# Altium schematic sheet SMPS_Template.SchDoc
size A3 portrait; SheetNumber: 1; SheetTotal: 1
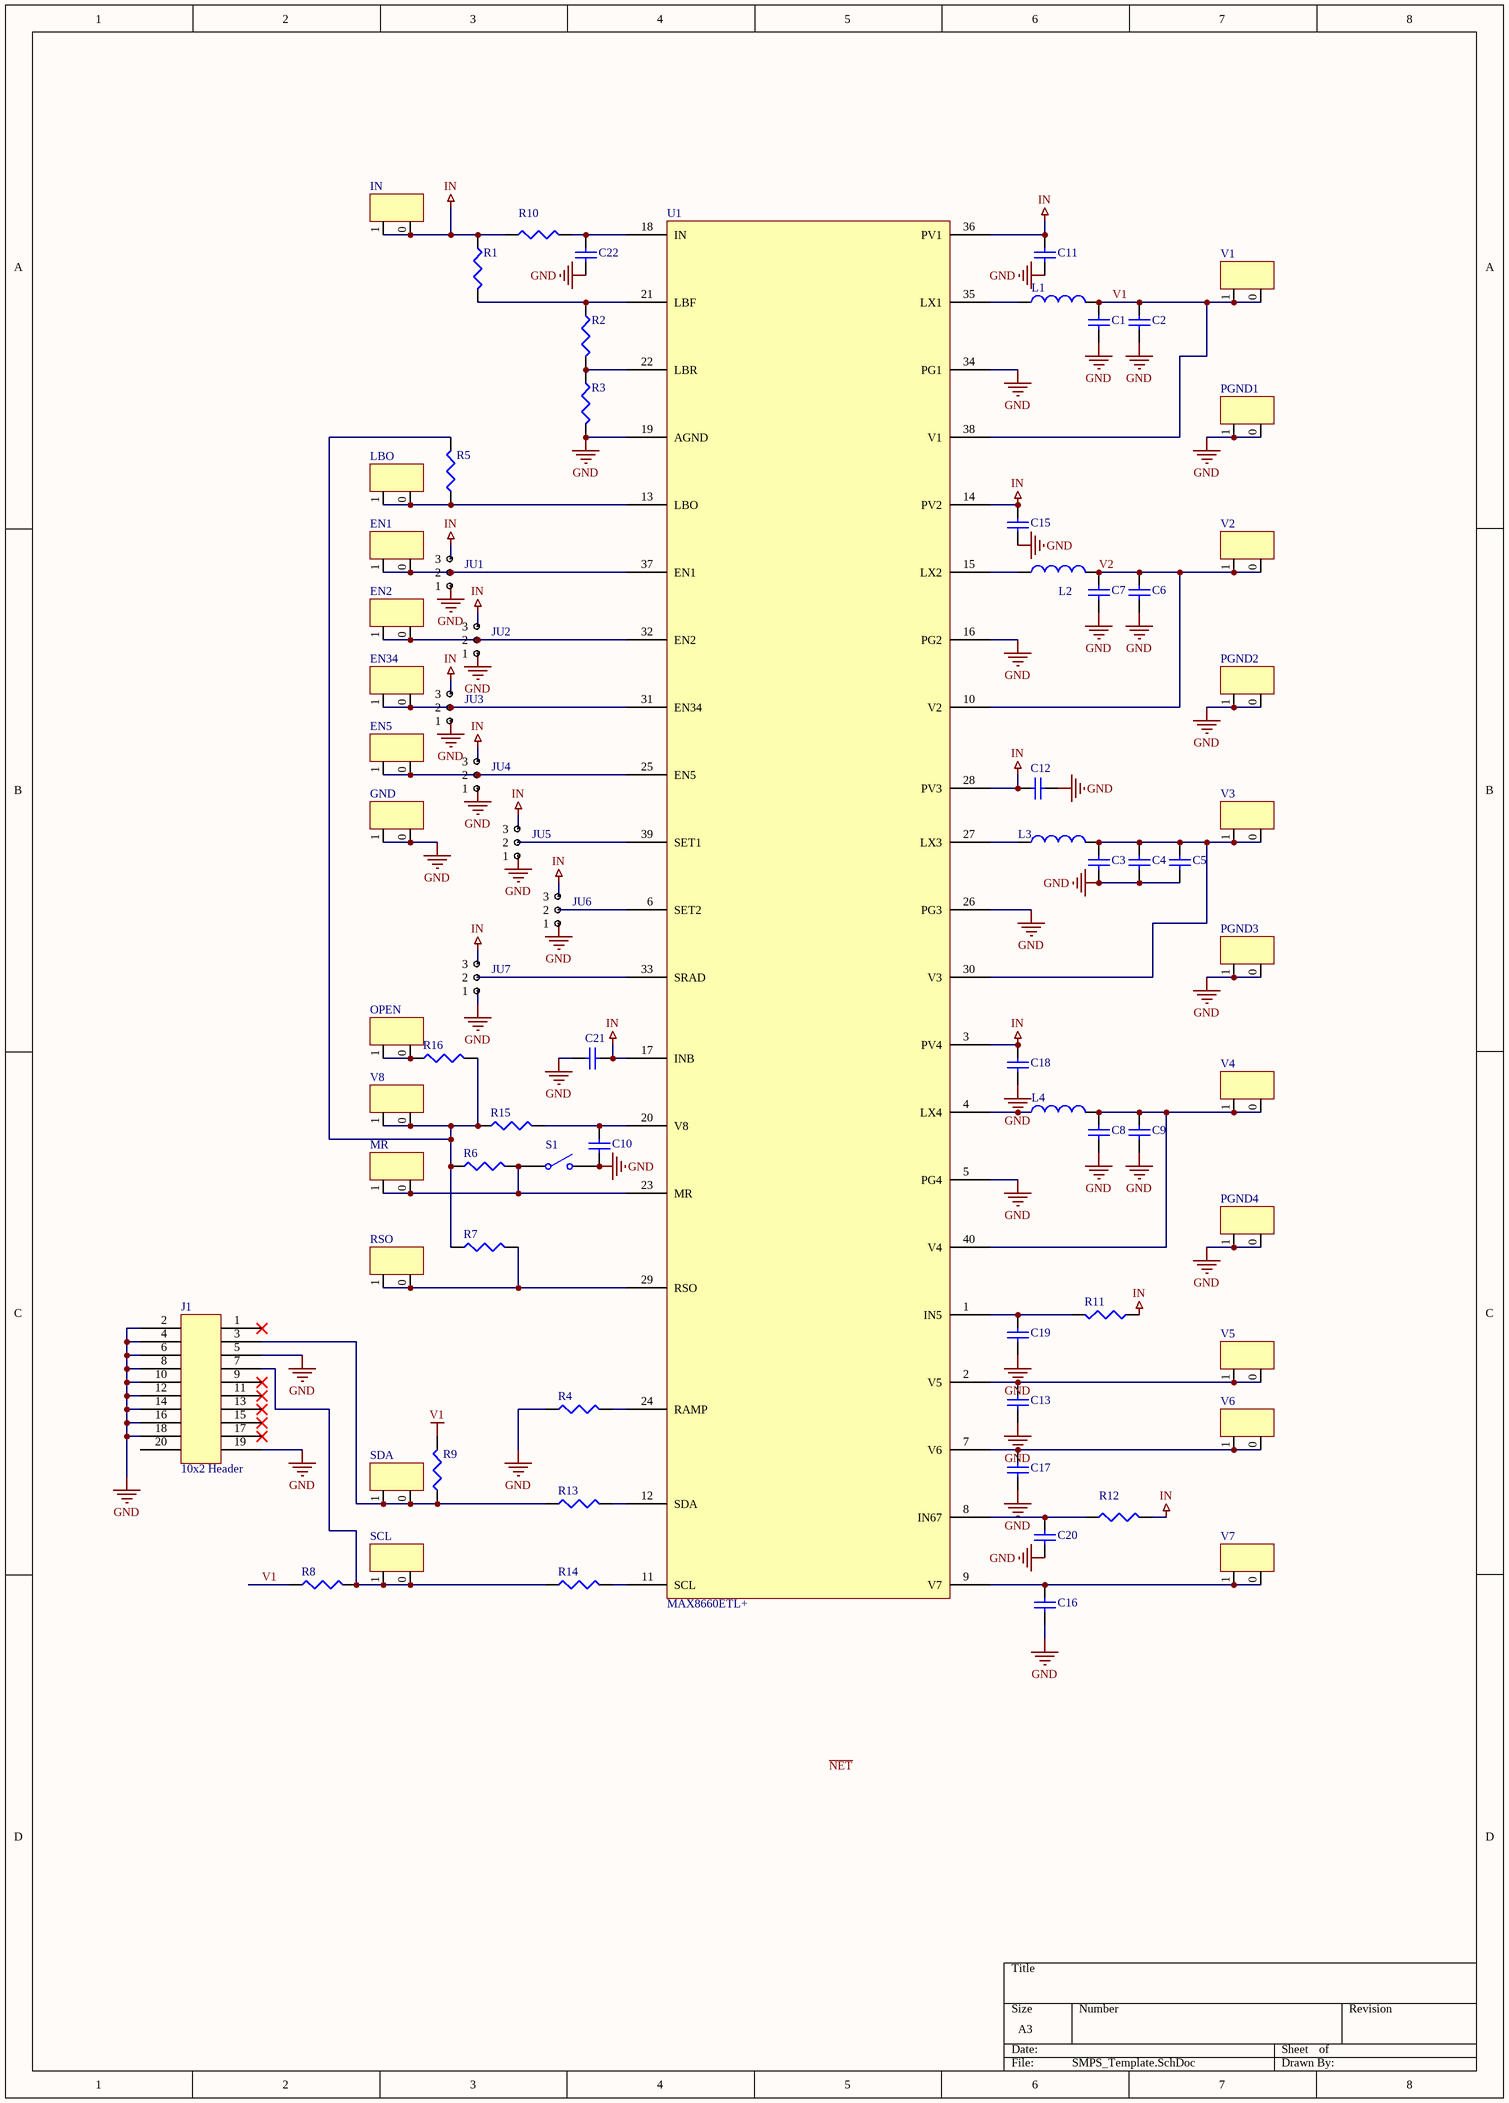
[diagram p0: SMPS_Template.SchDoc]

## Parts
C1  Cap  [2012[0805]]  (value not drawn)
C2  Cap  [2012[0805]]  (value not drawn)
C3  Cap  [2012[0805]]  (value not drawn)
C4  Cap  [2012[0805]]  (value not drawn)
C5  Cap  [2012[0805]]  (value not drawn)
C6  Cap  [2012[0805]]  (value not drawn)
C7  Cap  [2012[0805]]  (value not drawn)
C8  Cap  [2012[0805]]  (value not drawn)
C9  Cap  [2012[0805]]  (value not drawn)
C10  Cap  [1005[0402]]  (value not drawn)
C11  Cap  [1608[0603]]  (value not drawn)
C12  Cap  [1608[0603]]  (value not drawn)
C13  Cap  [1608[0603]]  (value not drawn)
C15  Cap  [1608[0603]]  (value not drawn)
C16  Cap  [1608[0603]]  (value not drawn)
C17  Cap  [1608[0603]]  (value not drawn)
C18  Cap  [1608[0603]]  (value not drawn)
C19  Cap  [1608[0603]]  (value not drawn)
C20  Cap  [1608[0603]]  (value not drawn)
C21  Cap  [1005[0402]]  (value not drawn)
C22  Cap  [1005[0402]]  (value not drawn)
EN1  2-pin Header  [CON_1]  (value not drawn)
EN2  2-pin Header  [CON_1]  (value not drawn)
EN5  2-pin Header  [CON_1]  (value not drawn)
EN34  2-pin Header  [CON_1]  (value not drawn)
GND  2-pin Header  [CON_1]  (value not drawn)
IN  2-pin Header  [CON_1]  (value not drawn)
J1  10x2 Header  [HDR2X10]
JU1  3-pin Header  [CON3]  (value not drawn)
JU2  3-pin Header  [CON3]  (value not drawn)
JU3  3-pin Header  [CON3]  (value not drawn)
JU4  3-pin Header  [CON3]  (value not drawn)
JU5  3-pin Header  [CON3]  (value not drawn)
JU6  3-pin Header  [CON3]  (value not drawn)
JU7  3-pin Header  [CON3]  (value not drawn)
L1  Inductor  [INDC3225L]  (value not drawn)
L2  Inductor  [INDC3225L]  (value not drawn)
L3  Inductor  [INDC3225L]  (value not drawn)
L4  Inductor  [INDC3225L]  (value not drawn)
LBO  2-pin Header  [CON_1]  (value not drawn)
MR  2-pin Header  [CON_1]  (value not drawn)
OPEN  2-pin Header  [CON_1]  (value not drawn)
PGND1  2-pin Header  [CON_1]  (value not drawn)
PGND2  2-pin Header  [CON_1]  (value not drawn)
PGND3  2-pin Header  [CON_1]  (value not drawn)
PGND4  2-pin Header  [CON_1]  (value not drawn)
R1  Res3  [1005[0402]]  (value not drawn)
R2  Res3  [1005[0402]]  (value not drawn)
R3  Res3  [1005[0402]]  (value not drawn)
R4  Res3  [1005[0402]]  (value not drawn)
R5  Res3  [2012[0805]]  (value not drawn)
R6  Res3  [2012[0805]]  (value not drawn)
R7  Res3  [2012[0805]]  (value not drawn)
R8  Res3  [2012[0805]]  (value not drawn)
R9  Res3  [2012[0805]]  (value not drawn)
R10  20 Ohm  [1005[0402]]  (value not drawn)
R11  Res3  [1005[0402]]  (value not drawn)
R12  Res3  [1005[0402]]  (value not drawn)
R13  Res3  [2012[0805]]  (value not drawn)
R14  Res3  [2012[0805]]  (value not drawn)
R15  SHORT  [2012[0805]]  (value not drawn)
R16  OPEN  [2012[0805]]  (value not drawn)
RSO  2-pin Header  [CON_1]  (value not drawn)
S1  SW-SPST  [PUSH_SWITCH]  (value not drawn)
SCL  2-pin Header  [CON_1]  (value not drawn)
SDA  2-pin Header  [CON_1]  (value not drawn)
U1  MAX8660ETL+  [MAX8660_QFN]
V1  2-pin Header  [CON_1]  (value not drawn)
V2  2-pin Header  [CON_1]  (value not drawn)
V3  2-pin Header  [CON_1]  (value not drawn)
V4  2-pin Header  [CON_1]  (value not drawn)
V5  2-pin Header  [CON_1]  (value not drawn)
V6  2-pin Header  [CON_1]  (value not drawn)
V7  2-pin Header  [CON_1]  (value not drawn)
V8  2-pin Header  [CON_1]  (value not drawn)

## Nets
GND: C1.1 C2.1 C3.1 C4.1 C5.1 C6.1 C7.1 C8.1 C9.1 C10.2 C11.1 C12.1 C13.1 C15.1 C16.1 C17.1 C18.1 C19.1 C20.1 C21.2 C22.1 GND.0 GND.1 J1.2 J1.4 J1.5 J1.6 J1.8 J1.10 J1.12 J1.14 J1.16 J1.18 J1.19 JU1.1 JU2.1 JU3.1 JU4.1 JU5.1 JU6.1 JU7.1 PGND1.0 PGND1.1 PGND2.0 PGND2.1 PGND3.0 PGND3.1 PGND4.0 PGND4.1 R3.2 R4.1 S1.2(NO) U1.5(PG4) U1.16(PG2) U1.19(AGND) U1.26(PG3) U1.34(PG1)
IN: C11.2 C12.2 C15.2 C18.2 C21.1 IN.0 IN.1 JU1.3 JU2.3 JU3.3 JU4.3 JU5.3 JU6.3 JU7.3 R1.1 R10.1 R11.1 R12.2 U1.3(PV4) U1.14(PV2) U1.17(INB) U1.28(PV3) U1.36(PV1)
V1: C1.2 C2.2 L1.2 R8.1 R9.2 U1.38(V1) V1.0 V1.1
V2: C6.2 C7.2 L2.2 U1.10(V2) V2.0 V2.1
NetC3_2: C3.2 C4.2 C5.2 L3.2 U1.30(V3) V3.0 V3.1
NetC8_2: C8.2 C9.2 L4.2 U1.40(V4) V4.0 V4.1
NetC10_1: C10.1 R15.2 U1.20(V8)
NetC13_2: C13.2 U1.2(V5) V5.0 V5.1
NetC16_2: C16.2 U1.9(V7) V7.0 V7.1
NetC17_2: C17.2 U1.7(V6) V6.0 V6.1
NetC19_2: C19.2 R11.2 U1.1(IN5)
NetC20_2: C20.2 R12.1 U1.8(IN67)
NetC22_2: C22.2 R10.2 U1.18(IN)
NetEN1_0: EN1.0 EN1.1 JU1.2 U1.37(EN1)
NetEN2_0: EN2.0 EN2.1 JU2.2 U1.32(EN2)
NetEN5_0: EN5.0 EN5.1 JU4.2 U1.25(EN5)
NetEN34_0: EN34.0 EN34.1 JU3.2 U1.31(EN34)
NetJ1_3: J1.3 R9.1 R13.1 SDA.0 SDA.1
NetJ1_7: J1.7 R8.2 R14.1 SCL.0 SCL.1
NetJU5_2: JU5.2 U1.39(SET1)
NetJU6_2: JU6.2 U1.6(SET2)
NetJU7_2: JU7.2 U1.33(SRAD)
NetL1_1: L1.1 U1.35(LX1)
NetL2_1: L2.1 U1.15(LX2)
NetL3_1: L3.1 U1.27(LX3)
NetL4_1: L4.1 U1.4(LX4)
NetLBO_0: LBO.0 LBO.1 R5.1 U1.13(LBO)
NetMR_0: MR.0 MR.1 R6.2 S1.1(COMMON) U1.23(MR)
NetOPEN_0: OPEN.0 OPEN.1 R16.1
NetR1_2: R1.2 R2.1 U1.21(LBF)
NetR2_2: R2.2 R3.1 U1.22(LBR)
NetR4_2: R4.2 U1.24(RAMP)
NetR5_2: R5.2 R6.1 R7.1 R15.1 R16.2 V8.0 V8.1
NetR7_2: R7.2 RSO.0 RSO.1 U1.29(RSO)
NetR13_2: R13.2 U1.12(SDA)
NetR14_2: R14.2 U1.11(SCL)

Not connected (* = marked no-connect by the designer): J1 1(0)* 9(8)* 11(10)* 13(12)* 15(14)* 17(16)* 20(19)

## Notes on the sheet
- Labels drawn without touching a wire or pin: ~{NET}

## Library data of the parts
C1-C13 C15-C22 = Cap: Capacitor; Value: 100pF; Published: 8-Jun-2000; LatestRevisionDate: 17-Jul-2002; LatestRevisionNote: Re-released for DXP Platform.; PackageReference: RAD-0.3; Publisher: Altium Limited
L1-L4 = Inductor: Code_IEC: 1005; Value: 10mH; Published: 8-Jun-2000; LatestRevisionDate: 17-Jul-2002; LatestRevisionNote: Re-released for DXP Platform.; PackageReference: 0402-A; Publisher: Altium Limited; Code_JEITA: 0402
R1-R16 = Res3: Resistor; Value: 1K; Published: 8-Jun-2000; LatestRevisionDate: 04-Mar-2005; LatestRevisionNote: PCB Footprint replaced.; PackageReference: J1-0603; Publisher: Altium Limited
S1 = SW-SPST: Single-Pole, Single-Throw Switch; Published: 24-Mar-1999; LatestRevisionDate: 17-Jul-2002; LatestRevisionNote: Re-released for DXP Platform.; PackageReference: SPST-2; Publisher: Altium Limited